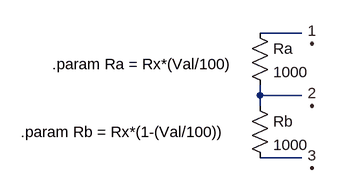
[diagram p0: schematic potentiometer.asc]
potentiometer.asc, the LTspice schematic file:
Version 4
SHEET 1 880 680
WIRE 144 48 80 48
WIRE 80 144 80 128
WIRE 144 144 80 144
WIRE 80 160 80 144
WIRE 144 240 80 240
FLAG 160 64 1
FLAG 160 160 2
FLAG 160 256 3
SYMBOL res 64 32 R0
SYMATTR InstName Ra
SYMATTR Value 1000
SYMBOL res 64 144 R0
SYMATTR InstName Rb
SYMATTR Value 1000
TEXT -240 96 Left 2 !.param Ra = Rx*(Val/100)
TEXT -288 200 Left 2 !.param Rb = Rx*(1-(Val/100))

The netlist it stands for:
* potentiometer.asc
Ra N001 N002 1000
Rb N002 N003 1000
.param Ra = Rx*(Val/100)
.param Rb = Rx*(1-(Val/100))
.backanno
.end